# Altium schematic sheet Shunt_Filter.SchDoc: <Document>
size Letter; Engineer: <Engineer>; Organization: UPEL; Address1: USU Power Electronics Lab; Address2: USTAR Building 620, RM 118; Address3: 1600 N 620 E; Address4: North Logan, UT 84341; DocumentNumber: 3; Revision: v1; SheetNumber: 3; SheetTotal: 16; ProjectName: <Project>
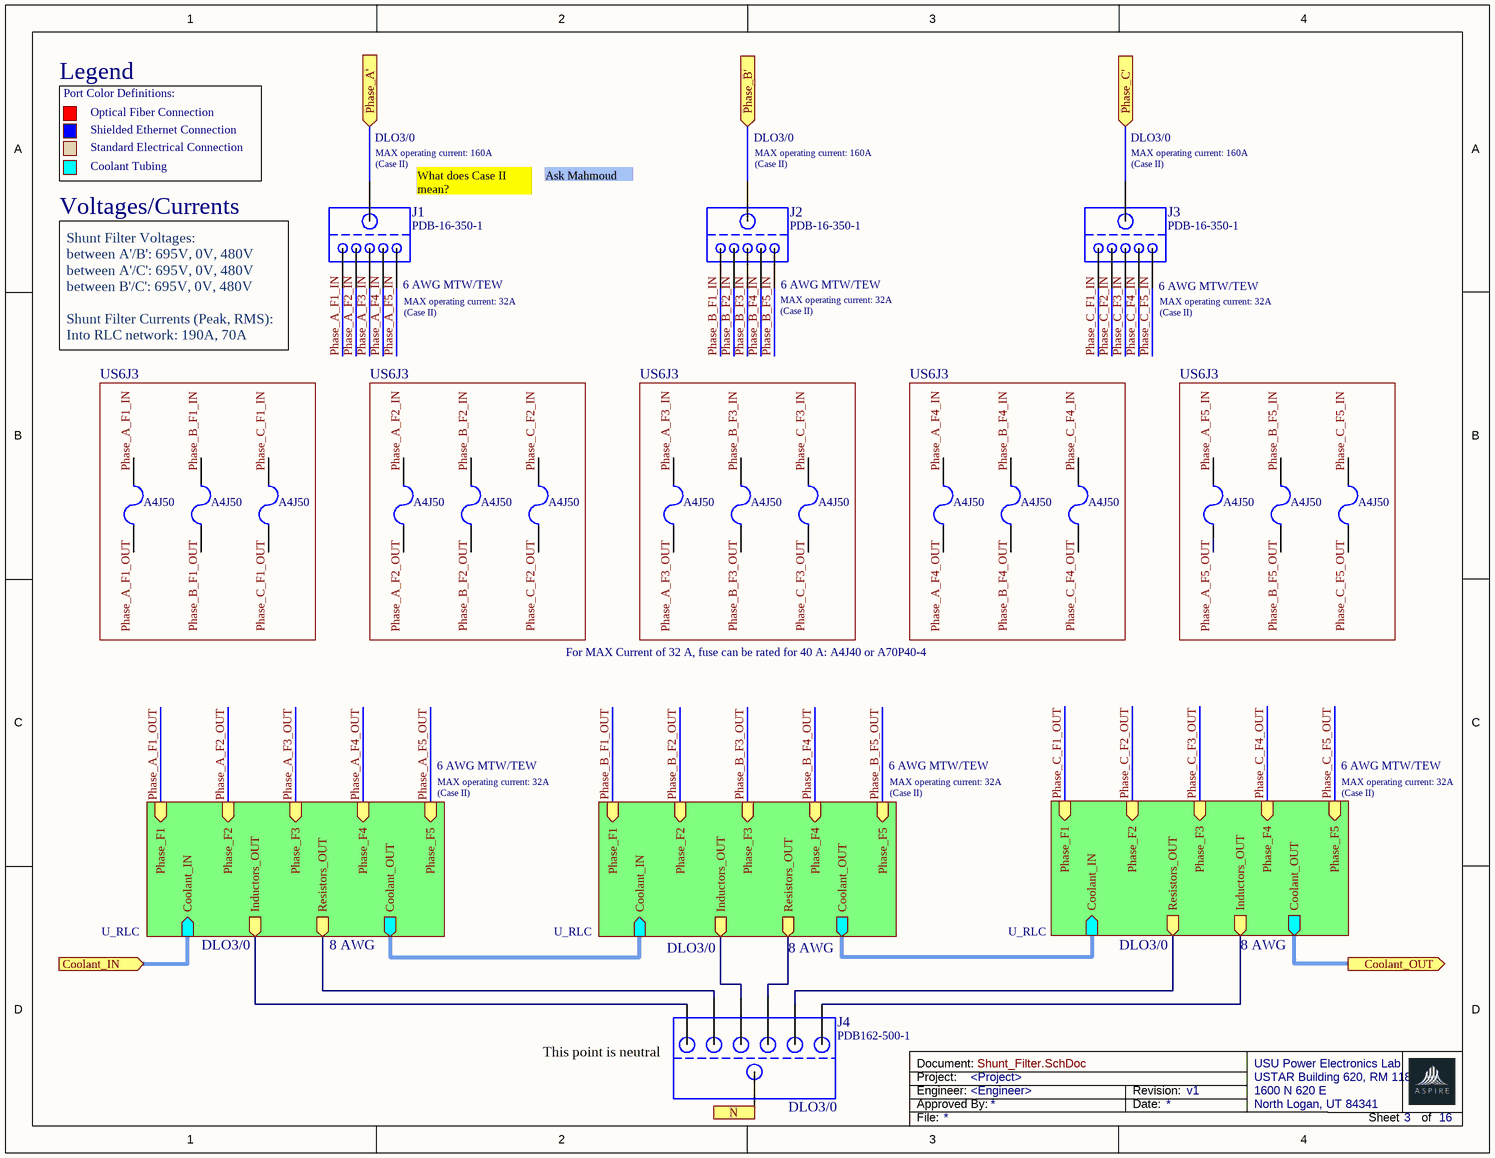
[diagram p0: Shunt_Filter.SchDoc]

## Parts
F1  A4J50  [PIN-W2/E2.8]
F2  A4J50  [PIN-W2/E2.8]
F3  A4J50  [PIN-W2/E2.8]
F4  A4J50  [PIN-W2/E2.8]
F5  A4J50  [PIN-W2/E2.8]
F7  A4J50  [PIN-W2/E2.8]
F8  A4J50  [PIN-W2/E2.8]
F9  A4J50  [PIN-W2/E2.8]
F10  A4J50  [PIN-W2/E2.8]
F11  A4J50  [PIN-W2/E2.8]
F12  A4J50  [PIN-W2/E2.8]
F13  A4J50  [PIN-W2/E2.8]
F14  A4J50  [PIN-W2/E2.8]
F15  A4J50  [PIN-W2/E2.8]
F16  A4J50  [PIN-W2/E2.8]
J1  PDB-16-350-1
J2  PDB-16-350-1
J3  PDB-16-350-1
J4  PDB162-500-1

## Blocks framed on the sheet
US6J3: F1-F3
US6J3: F4 F5 F7
US6J3: F8-F10
US6J3: F11-F13
US6J3: F14-F16

## Sub-sheets
U_RLC = RLC.SchDoc: Phase_F1 (in), Phase_F2 (in), Phase_F3 (in), Phase_F4 (in), Phase_F5 (in), Inductors_OUT (out), Resistors_OUT (out), Coolant_IN (in), Coolant_OUT (out)
U_RLC = RLC.SchDoc: Phase_F1 (in), Phase_F2 (in), Phase_F3 (in), Phase_F4 (in), Phase_F5 (in), Resistors_OUT (out), Inductors_OUT (out), Coolant_IN (in), Coolant_OUT (out)
U_RLC = RLC.SchDoc: Phase_F1 (in), Phase_F2 (in), Phase_F3 (in), Phase_F4 (in), Phase_F5 (in), Resistors_OUT (out), Inductors_OUT (out), Coolant_OUT (out), Coolant_IN (in)

## Ports
Coolant_IN (in), Coolant_OUT (out), N (in), Phase_A' (in), Phase_B' (in), Phase_C' (in)

## Nets
Coolant_IN: port Coolant_IN, sheet U_RLC/Coolant_IN
Coolant_OUT: port Coolant_OUT, sheet U_RLC/Coolant_OUT
N: J4.0 ; port N
Phase_A': J1.0 ; port Phase_A'
Phase_A_F1_IN: J1.1
Phase_A_F1_OUT: sheet U_RLC/Phase_F1
Phase_A_F2_IN: J1.2
Phase_A_F2_OUT: sheet U_RLC/Phase_F2
Phase_A_F3_IN: J1.3
Phase_A_F3_OUT: sheet U_RLC/Phase_F3
Phase_A_F4_IN: J1.4
Phase_A_F4_OUT: sheet U_RLC/Phase_F4
Phase_A_F5_IN: J1.5
Phase_A_F5_OUT: F14.1 ; sheet U_RLC/Phase_F5
Phase_B': J2.0 ; port Phase_B'
Phase_B_F1_IN: J2.1
Phase_B_F1_OUT: sheet U_RLC/Phase_F1
Phase_B_F2_IN: J2.2
Phase_B_F2_OUT: sheet U_RLC/Phase_F2
Phase_B_F3_IN: J2.3
Phase_B_F3_OUT: sheet U_RLC/Phase_F3
Phase_B_F4_IN: J2.4
Phase_B_F4_OUT: sheet U_RLC/Phase_F4
Phase_B_F5_IN: J2.5
Phase_B_F5_OUT: sheet U_RLC/Phase_F5
Phase_C': J3.0 ; port Phase_C'
Phase_C_F1_IN: J3.1
Phase_C_F1_OUT: sheet U_RLC/Phase_F1
Phase_C_F2_IN: J3.2
Phase_C_F2_OUT: sheet U_RLC/Phase_F2
Phase_C_F3_IN: J3.3
Phase_C_F3_OUT: sheet U_RLC/Phase_F3
Phase_C_F4_IN: J3.4
Phase_C_F4_OUT: sheet U_RLC/Phase_F4
Phase_C_F5_IN: J3.5
Phase_C_F5_OUT: sheet U_RLC/Phase_F5
NetJ4_0: J4.0 ; sheet U_RLC/Inductors_OUT
NetJ4_0: J4.0 ; sheet U_RLC/Resistors_OUT  [a separate net that carries the same name]
NetJ4_0: J4.0 ; sheet U_RLC/Inductors_OUT  [a separate net that carries the same name]
NetJ4_0: J4.0 ; sheet U_RLC/Resistors_OUT  [a separate net that carries the same name]
NetJ4_0: J4.0 ; sheet U_RLC/Resistors_OUT  [a separate net that carries the same name]
NetJ4_0: J4.0 ; sheet U_RLC/Inductors_OUT  [a separate net that carries the same name]
(unnamed): sheet U_RLC/Coolant_OUT, sheet U_RLC/Coolant_IN
(unnamed): sheet U_RLC/Coolant_OUT, sheet U_RLC/Coolant_IN

Not connected (* = marked no-connect by the designer): F1 1 2; F2 1 2; F3 1 2; F4 1 2; F5 1 2; F7 1 2; F8 1 2; F9 1 2; F10 1 2; F11 1 2; F12 1 2; F13 1 2; F14 2; F15 1 2; F16 1 2

## Notes on the sheet
- Legend
- Port Color Definitions:
- Optical Fiber Connection
- Shielded Ethernet Connection
- Standard Electrical Connection
- (near J1) MAX operating current: 160A
  (Case II)
- DLO3/0
- (near J2) MAX operating current: 160A
  (Case II)
- (near J3) MAX operating current: 160A
  (Case II)
- Voltages/Currents
- Coolant Tubing
- (near J1) What does Case II mean?
- Ask Mahmoud
- (near J1) 6 AWG MTW/TEW
- (near J2) 6 AWG MTW/TEW
- (near J3) 6 AWG MTW/TEW
- Shunt Filter Voltages:
  between A'/B': 695V, 0V, 480V
  between A'/C': 695V, 0V, 480V
  between B'/C': 695V, 0V, 480V
  Shunt Filter Currents (Peak, RMS):
  Into RLC network: 190A, 70A
- (near J1) MAX operating current: 32A
  (Case II)
- (near J2) MAX operating current: 32A
  (Case II)
- (near J3) MAX operating current: 32A
  (Case II)
- For MAX Current of 32 A, fuse can be rated for 40 A: A4J40 or A70P40-4
- 6 AWG MTW/TEW
- MAX operating current: 32A
  (Case II)
- 8 AWG
- (near J4) This point is neutral
- (near J4) DLO3/0
- Labels drawn without touching a wire or pin: Phase_A_F1_IN, Phase_A_F1_OUT, Phase_A_F2_IN, Phase_A_F2_OUT, Phase_A_F3_IN, Phase_A_F3_OUT, Phase_A_F4_IN, Phase_A_F4_OUT, Phase_A_F5_IN, Phase_B_F1_IN, Phase_B_F1_OUT, Phase_B_F2_IN, Phase_B_F2_OUT, Phase_B_F3_IN, Phase_B_F3_OUT, Phase_B_F4_IN, Phase_B_F4_OUT, Phase_B_F5_IN, Phase_B_F5_OUT, Phase_C_F1_IN, Phase_C_F1_OUT, Phase_C_F2_IN, Phase_C_F2_OUT, Phase_C_F3_IN, Phase_C_F3_OUT, Phase_C_F4_IN, Phase_C_F4_OUT, Phase_C_F5_IN, Phase_C_F5_OUT
- Project:
- Engineer:
- Document:
- Approved By:
- Date:
- Revision:
- File:
- Sheet
- of

## Library data of the parts
F1-F5 F7-F16 = Fuse 2: Fuse; Published: 8-Jun-2000; LatestRevisionDate: 17-Jul-2002; LatestRevisionNote: Re-released for DXP Platform.; PackageReference: PIN-W2/E2.8; Publisher: Altium Limited; PackageDescription: Thru-Hole; 2 Leads